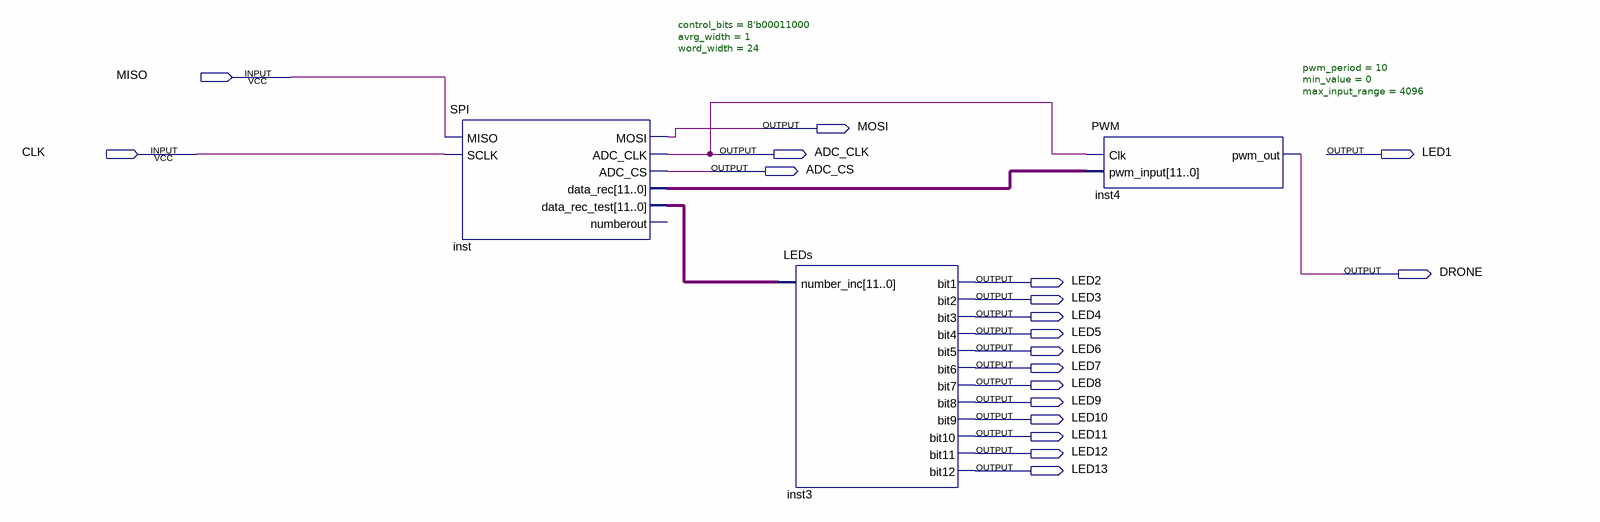
[diagram p0: schematic sheet]
// Quartus schematic licence_project.bdf as structural Verilog: 3 symbols, 19 pins
module licence_project (
  input  MISO,
  input  CLK,
  output MOSI,
  output ADC_CLK,
  output LED1,
  output ADC_CS,
  output DRONE,
  output LED2,
  output LED3,
  output LED4,
  output LED5,
  output LED6,
  output LED7,
  output LED8,
  output LED9,
  output LED10,
  output LED11,
  output LED12,
  output LED13
);

  wire [11:0] inst_data_rec, inst_data_rec_test;

  SPI #(.control_bits(8'b00011000), .avrg_width(1), .word_width(24)) inst (
    .MISO(MISO), .SCLK(CLK), .MOSI(MOSI), .ADC_CLK(ADC_CLK), .ADC_CS(ADC_CS), .data_rec(inst_data_rec),
    .data_rec_test(inst_data_rec_test));  // open: numberout
  LEDs inst3 (
    .number_inc(inst_data_rec_test), .bit1(LED2), .bit2(LED3), .bit3(LED4), .bit4(LED5), .bit5(LED6),
    .bit6(LED7), .bit7(LED8), .bit8(LED9), .bit9(LED10), .bit10(LED11), .bit11(LED12), .bit12(LED13));
  PWM #(.pwm_period(10), .min_value(0), .max_input_range(4096)) inst4 (
    .Clk(ADC_CLK), .pwm_input(inst_data_rec), .pwm_out(DRONE));
endmodule
